# Altium schematic sheet HAL_1.SchDoc
size A
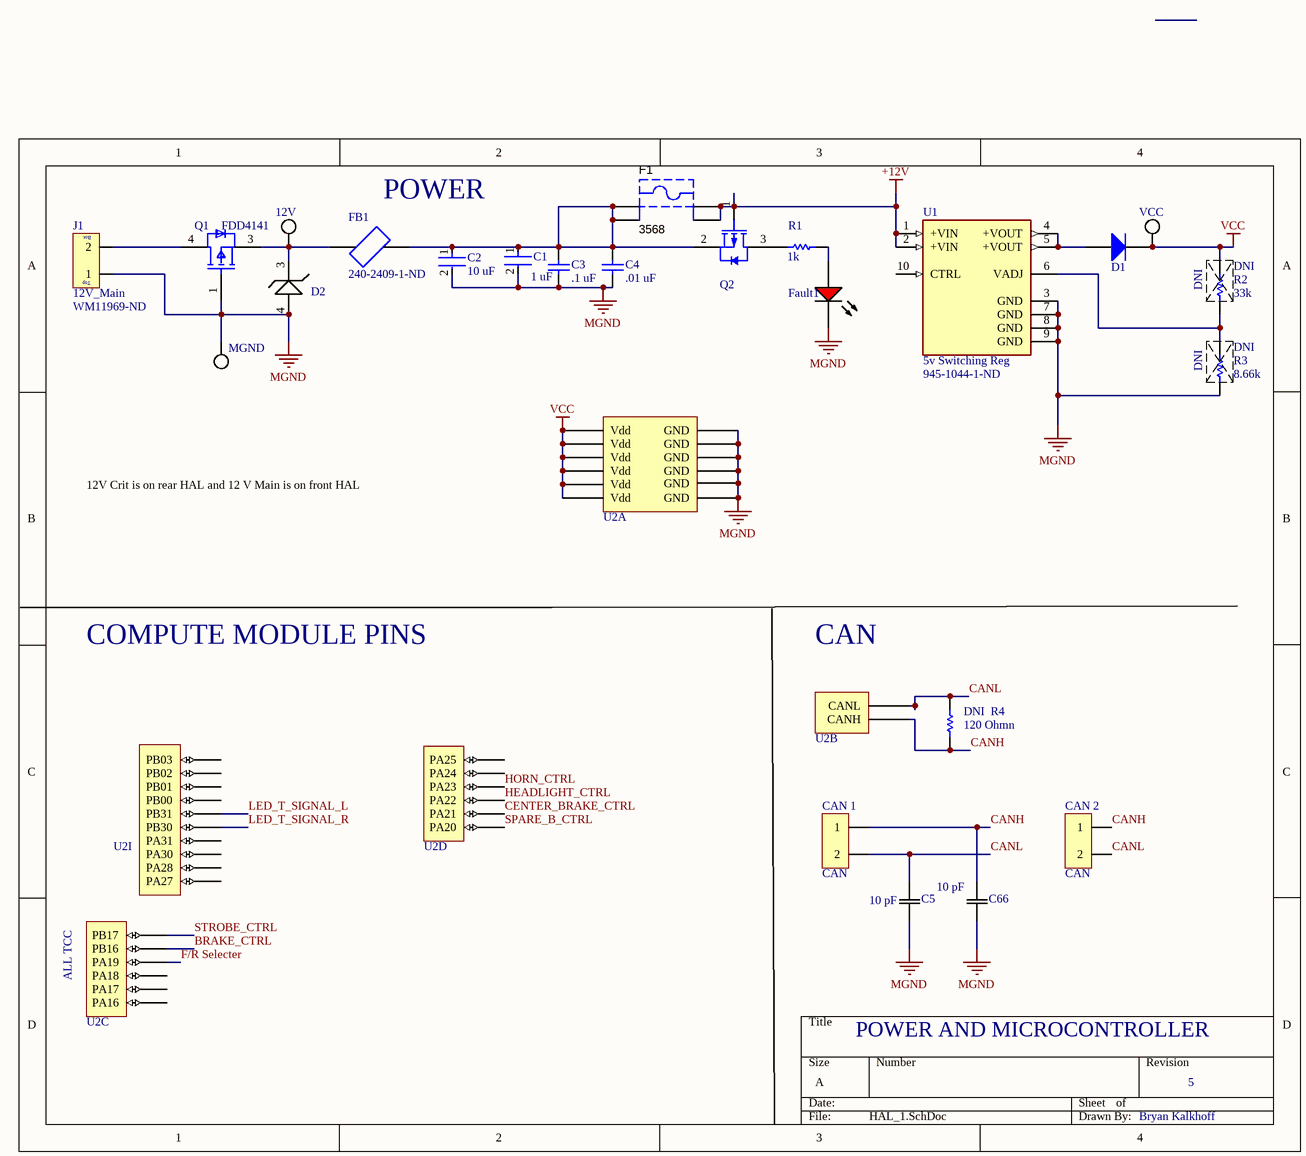
[diagram p0: HAL_1.SchDoc]

## Parts
(Parts that share a designator on the sheet are numbered #1, #2 ... from top to bottom, then left to right.)
12V  12V crit  [EPAD]  (value not drawn)  (no BOM)
C1  1 uF  [FP-CL31-IPC_A]
C2  10 uF  [FP-CL31-IPC_A]
C3  .1 uF  [CAPC2013X140X50LL20T25]
C4  .01 uF  [CAPC1608X90X35LL15T15]
C5  10 pF  [CAP_CL21_SAM-M]
C66  10 pF  [CAP_CL21_SAM-M]
CAN_1  CAN  [Mini-Fit Jr. 2]
CAN_2  CAN  [Mini-Fit Jr. 2]
D1  1N4001-T  [DIOD-DO-41-P-2_V]  (value not drawn)
D2  TVS DIODE 12.4V 20.1V DO219AB  [TVS DIODE 12.4V 20.1V DO219AB]  (value not drawn)
DNI?#1  DO NOT INSTALL  (value not drawn)  (graphical)
DNI?#2  DO NOT INSTALL  (value not drawn)  (graphical)
F1  3568  [KSTN-3568_V]
Fault1  HSMH-C150  [AVAG-HSMX-C150_V]  (value not drawn)
FB1  Supplier Part Number 1: 240-2409-1-ND  [80_FB_1206]  (hidden comment: HI1206N800R-10)
J1  12V_Main  Supplier Part Number 1: WM11969-ND  [MEGA_2P_2x1]
MGND  MGND  [EPAD]  (value not drawn)  (no BOM)
Q1  FDD4141  [FP-369AS-MFG]
Q2  IRLML6402TRPBF  [INTR-SOT-23-3_V]  (value not drawn)
R1  1k  [RESC3216X70X40LL20T20]
R2  33k  [RESC2013X50X30LL20T20]
R3  8.66k  [RESC2013X60X35ML10T20]
R4  120 Ohmn  [RESC2013X50X40LL20T20]
U1  5v Switching Reg  Supplier Part Number 1: 945-1044-1-ND  [10-SMD]
U2  S+  [Compute S+]  (value not drawn)  (parts A,B,C,D,I of 9)
VCC  VCC  [EPAD]  (value not drawn)  (no BOM)

## Nets
+12V: F1.3 F1.4 Q2.1(GATE) U1.1(+VIN) U1.2(+VIN)
MGND: C1.2 C2.2 C3.1 C4.1 C5.1 C66.1 D2.4 Fault1.2(K) J1.1 MGND.1 Q1.1(G) R3.1 U1.3(GND) U1.7(GND) U1.8(GND) U1.9(GND) U2.GND
VCC: D1.2(K) R2.2 U2.Vdd VCC.1
BRAKE_CTRL: U2.PB16
CANH: C66.2 CAN_1.1 CAN_2.1 R4.2 U2.CANH
CANL: C5.2 CAN_1.2 CAN_2.2 R4.1 U2.CANL
CENTER_BRAKE_CTRL: U2.PA21
F/R Selecter: U2.PA19
HEADLIGHT_CTRL: U2.PA22
HORN_CTRL: U2.PA23
LED_T_SIGNAL_L: U2.PB31
LED_T_SIGNAL_R: U2.PB30
SPARE_B_CTRL: U2.PA20
STROBE_CTRL: U2.PB17
Net12V_1: 12V.1 D2.3 FB1.1 Q1.3(S)
NetC1_1: C1.1 C2.1 C3.2 C4.2 F1.1 F1.2 FB1.2 Q2.2(SOURCE)
NetD1_1: D1.1(A) U1.4(+VOUT) U1.5(+VOUT)
NetFault1_1: Fault1.1(A) R1.2
NetJ1_2: J1.2 Q1.4(D)
NetQ2_3: Q2.3(DRAIN) R1.1
NetR2_1: R2.1 R3.2 U1.6(VADJ)

Not connected (* = marked no-connect by the designer): U1 10(CTRL); U2 PA16 PA17 PA18 PA24 PA25 PA27 PA28 PA30 PA31 PB00 PB01 PB02 PB03

## Notes on the sheet
- POWER
- DNI
- 12V Crit is on rear HAL and 12 V Main is on front HAL
- COMPUTE MODULE PINS
- CAN
- (near R4) DNI
- (near U2) ALL TCC
- POWER AND MICROCONTROLLER
- 5
- Bryan Kalkhoff
- (in symbol MEGA_2P_2x1) Bot.; Top

## Library data of the parts
12V MGND VCC = EPAD: Pad for probing signals
C1 C2 = CMP-13271-002819-1: Cap Ceramic 10uF 16V X5R ±10% SMD 1206 +85°C Embossed T/R; Length: 3.2mm; Voltage: 16V; Thickness: 0.071inch; Width: 0.063inch; Radiation Hardening: No; Tolerance: 10%; Min Operating Temperature: -55°C; Mount: Surface Mount; Voltage Rating: 16V; Capacitance: 10uF; Material: Ceramic; Case Code (Metric): 3216; Depth: 1.6mm; Packaging: Tape and Reel; Lead Free: Lead Free; Dielectric: X5R; Contact Plating: Tin; Case Code (Imperial): 1206; Height: 1.6mm; Voltage Rating (DC): 16V; Max Operating Temperature: 85°C; Case/Package: 1206
C3 = CMP-2007-04740-1: Part Number: 08051C104M4Z2A; Manufacturer: AVX Interconnect / Elco
C4 = CMP-2006-04438-1: Part Number: 06035C472K4T4A; Manufacturer: AVX Interconnect / Elco
C5 C66 = CL21C100CBANNNC: No Description Available; Mfr_Name: Samsung; Type: DEV; Copyright: Copyright (C) 2021 Ultra Librarian. All rights reserved.; Manufacturer_Part_Number: CL21C100CBANNNC; Digi-Key_Part_Number_1: 1276-2561-2-ND; Digi-Key_Part_Number_2: 1276-2561-1-ND; Digi-Key_Part_Number_3: 1276-2561-6-ND; RefDes: RefDes
CAN_1 CAN_2 = Mini-Fit Jr. 2-pin: Mini-Fit Jr. 2-pin Right Angle Mini-Fit Jr. 2-pin; Manufacturer: Molex Inc; Manufacturer Part Number: 0039300020; Connector Type: Header, Shrouded; Number of Positions: 2; Number of Positions Loaded: All; Row Spacing: 0.165" (4.20mm); Ordering: http://search.digikey.com/scripts/DkSearch/dksus.dll?Detail&name=WM1351-ND; Datasheet: http://www.molex.com/pdm_docs/sd/039301020_sd.pdf; Supplier 1: Digi-Key; RoHS: RoHS Compliant; Category: Connectors, Interconnects; Stock 1: 371; Pricing 1: 1=0.77, 10=0.674, 50=0.6078, 100=0.5815, 250=0.5286, 500=0.47574, 1000=0.42288, 2500=0.38324, 5000=0.37002 (USD); Contact Type: Male Pin; Pitch: -; Number of Rows: 2; Contact Mating Length: -; Mounting Type: Through Hole, Right Angle; Termination: Solder; Fastening Type: Locking Ramp; Features: Board Lock; Contact Finish: Tin; Contact Finish Thickness: 200µin (5.08µm); Color: Natural; Packaging: Tray; ComponentLink1URL: http://www.molex.com/pdm_docs/sd/039300020_sd.pdf; ComponentLink1Description: http://www.molex.com/pdm_docs/sd/039300020_sd.pdf
D1 = CMP-0639-00006-2: 1.0 A Rectifier, 15 pF, 50 V, -65 to 150 degC, 2-Pin DO-41 Plastic, RoHS, Tape and Reel; Manufacturer: Diodes Inc; VF (V): 1; CT (pF): 15; Max. IR (uA): 5; VRRM (V): 50; Max. IFSM (A): 30; RoHS: TRUE; Mounting Technology: Through Hole; PartNumber: 1N4001-T; ComponentLink2Description: Datasheet; DatasheetVersion: Rev. 8-2; Operating Temperature Range (degC): -65 to 150; Packing: Tape and Reel; PackageReference: DO-41-P-2; ComponentLink1URL: http://diodes.com/; PackageDescription: 2-Pin Axial Lead, Body 4.635 x 2.36 mm, Lead Spread 25.4 mm; ComponentLink2URL: http://diodes.com/datasheets/ds28002.pdf; Max. Average Rectified Current IO (A): 1; ComponentLink1Description: Manufacturer URL
DNI?#1 DNI?#2 = DNI
F1 = CMP-2000-05464-1: Fuse Holder, 20 A, 500 V, -50 to 145 degC, 4-Pin THD, RoHS; Manufacturer: Keystone; Package Reference: 3568; Datasheet Version: 04/2013; Datasheet URL: https://datasheet.ciiva.com/16294/m60-2p40-16294706.pdf; Manufacturer URL: http://www.keyelco.com/; Mounting Technology: ThroughHole; Package Description: 4-Pin Through Hole Device, Body 16 x 6.73 mm, Pitch 9.9 mm
Fault1 = CMP-2000-06426-1: LED Uni-Color Red, 65 mW, 25 mA, -40 to 85 degC, 2-Pin SMD, RoHS, Tape and Reel; Manufacturer: Avago; Product Height (mm): 1.1mm; Power Dissipation: 78W; Product Length (mm): 3.2mm; Forward Voltage: 2.6V; Luminous Intensity: 17mcd; DELETED: Compliant; Shape Type: Rectangular; Peak Wavelength: 660nm; Main Category: ChipLED; Dominant Wave Length: 639nm; Rad Hardened: No; Lens Type: ColorlessDiffused; Product Depth (mm): 1.6mm; Reverse Voltage: 5V; Forward Current: 25mA; Chip Material: GaAlAs; Test Current (It): 20mA; Viewing Angle: 170deg; Number of  Elements: 1; Type: Uni-Color; Package Reference: HSMX-C150; Package Description: 2-Pin Surface Mount Device, Body 3.2 x 1.6 mm; Operating Temp Range: -40Cto85C; Mounting: SurfaceMount; Emitting Color: Red; Pin Count: 2; Operating Temperature Classification: Industrial; Datasheet URL: http://media.digikey.com/pdf/Data%20Sheets/Avago%20PDFs/HSMz-Czzz.pdf; Package Type: ChipLed; Mounting Technology: SurfaceMount; High Brightness: No; Lens Dimensions: 2x1.6x0.6mm; Manufacturer URL: http://www.avagotech.com/; Lum Intensity: 17mcd; Datasheet Version: 03/2012; Packaging: TapeandReel
FB1 = 80_FB_1206: Ferrite Chip, 1 Function(s), 3A, 2 Pin(s); Manufacturer: Laird Steward; Manufacturer Series: HI; MF: Laird-Signal Integrity; Value: 80R; DC Resistance-Max: 35mR; Number of Functions: 1; Max Frequency: 100MHz; SnapEDA_Link: https://www.snapeda.com/parts/HI1206N800R-10/Laird-Signal%20Integrity%20Products/view-part/296889/?ref=snap; Purchase-URL: https://pricing.snapeda.com/search/part/HI1206N800R-10/?ref=eda; Check_prices: https://www.snapeda.com/parts/HI1206N800R-10/Laird-Signal%20Integrity%20Products/view-part/296889/?ref=eda; Digi-Key_Part_Number: 240-2409-1-ND; Package: 1206 Laird-Signal Integrity; MP: HI1206N800R-10; Supplier 1: Digi-Key; Manufacturer Part Number: HI1206N800R-10; RoHS: Yes; Category: Fixed Inductors; Stock 1: 9365; Pricing 1: 1=0.23000, 10=0.18500, 25=0.14400, 50=0.11920, 100=0.10280, 250=0.08220, 500=0.07400, 1000=0.06166 (USD); Mount: Surface Mount; Terminal Finish: Nickel; Material: Ferrite; Case Code: 1206; Min Operating Temperature: -55°C; Max Operating Temperature: 125°C; JESD-609 Code: e3; Filter Type: FERRITE CHIP; Output Impedance: 80R; Packaging: Tape and Reel; Construction: Chip Bead; Min Frequency: 100MHz; Current Rating: 3A; Series: HI1206N800R; Length: 3.2mm; Width: 1.6mm; Height: 1.1mm; REACH SVHC: No SVHC; RoHS Compliant: Yes; ComponentLink1URL: https://datasheet.ciiva.com:443/pdfs/VipMasterIC/IC/STWD/STWDS00332/STWDS00332-1.pdf?src-supplier=IHS+Markit; ComponentLink1Description: https://datasheet.ciiva.com:443/pdfs/VipMasterIC/IC/STWD/STWDS00332/STWDS00332-1.pdf?src-supplier=IHS+Markit; ComponentLink2URL: https://datasheet.ciiva.com/3081/hi1206n800r-10-a-vp-3081809.pdf?src-supplier=Avnet; ComponentLink2Description: https://datasheet.ciiva.com/3081/hi1206n800r-10-a-vp-3081809.pdf?src-supplier=Avnet; ComponentLink3URL: https://datasheet.ciiva.com/22622/1685745-22622768.pdf?src-supplier=Element14; ComponentLink3Description: https://datasheet.ciiva.com/22622/1685745-22622768.pdf?src-supplier=Element14; ComponentLink4URL: https://datasheet.ciiva.com/16714/70065439-16714107.pdf?src-supplier=Allied+Electronics; ComponentLink4Description: https://datasheet.ciiva.com/16714/70065439-16714107.pdf?src-supplier=Allied+Electronics
J1 = MEGA_2P_2x1: MOLEX - 76825-0002 - Wire-To-Board Connector, 2 Contacts, Header, Mega-Fit 76825 Series, Through Hole, 2 Rows; Manufacturer Part Number: 0768250002; SchematicInformation: MegaFit_2P; Manufacturer: Molex; DigiKey Part Number: WM11969-ND; Supplier 1: Digi-Key; RoHS: Yes; Category: Headers and Wire Housings; Stock 1: 16040; Pricing 1: 1=1.31000, 10=1.08200, 80=0.90150, 1850=0.67615, 3700=0.65361 (USD); ComponentLink1URL: http://www.farnell.com/datasheets/2216551.pdf?src-supplier=Farnell; ComponentLink1Description: http://www.farnell.com/datasheets/2216551.pdf?src-supplier=Farnell; ComponentLink2URL: https://www.molex.com/pdm_docs/sd/768250002_sd.pdf?src-supplier=Digi-Key; ComponentLink2Description: https://www.molex.com/pdm_docs/sd/768250002_sd.pdf?src-supplier=Digi-Key; ComponentLink3URL: http://www.farnell.com/datasheets/2216551.pdf?src-supplier=Newark; ComponentLink3Description: http://www.farnell.com/datasheets/2216551.pdf?src-supplier=Newark
Q1 = CMP-07173-000088-1: MOSFET P-CH 40V 10.8A DPAK; Manufacturer: ON Semiconductor; Gate Charge At Vgs: 36nC @ -10V; Transconductance: 38S; Drain To Source Breakdown Voltage: -40V; Reverse Recovery Time: 29ns; Pulse Drain Current: -100A; Reverse Recovery Charge: 26nC; Drain To Source Resistance: 10.1mΩ; Power Dissipation: 2.4W; Max Forward Diode Voltage: -1.2V; Turn Off Delay Time: 38ns; Number Of P Channels: 1; Gate To Source Voltage: 20V; Rthja Max: 52°C/W; Depletion Mode: False; Threshold Vgs Max: -3V; Threshold Vgs Min: -1V; Turn On Delay Time: 10ns; Max Junction Temp: +150°C; Input Capacitace At Vds: 2085pF @ -20V; Continuous Drain Current: -10.8A; Typ Forward Diode Voltage: -0.8V; Package: 369AS; Category: Diode; RoHS: TRUE; Device Class L2: Transistors; Octopart: https://octopart.com/fdd4141-on+semiconductor-84325802; Temperature: -55°C to +150°C; Drain To Source Voltage: -40V; Device Class L1: Discrete Semiconductors; Temperature Range Low: -55°C; Height: 2.517mm; ComponentLink2Description: Datasheet; Automotive: No; Number Of Channels: 1; Digikey Description: MOSFET P-CH 40V 10.8A DPAK; Lead Free: Yes; Manufacturer Part Number: FDD4141; Temperature Range High: +150°C; Footprint Url: https://www.onsemi.com/pub/Collateral/369AS.PDF; Device Class L3: MOSFETs; Mouser Description: MOSFET -40V P-Channel PowerTrench; ComponentLink2URL: https://www.onsemi.com/pub/Collateral/FDD4141-D.pdf
Q2 = CMP-2000-04987-1: HEXFET(R) Power P-Channel MOSFET, -20 V, -3.7 A, -55 to 150 degC, 3-Pin SOT-23, RoHS, Tape and Reel; Manufacturer: International Rectifier; Drain-to-Source Voltage [Vdss]: 20V; Rated Power Dissipation: 1.3W; Qg Gate Charge: 8nC; Drain-Source On Resistance-Max: 0.065O; Channel Type: P-Channel; Package Reference: SOT-23-3; Manufacturer URL: http://internationalrectifier.com/; Datasheet URL: http://datasheet.octopart.com/IRLML6402TRPBF-International-Rectifier-datasheet-93882.pdf; Datasheet Version: Feb-05; Package Description: 3-Pin Small Outline Transistor, Body 2.92 x 1.3 mm, Pitch 0.95 mm
R1 = CMP-2003-04517-1: RK73B2BTTD102J; Manufacturer: KOA Speer; Part Number: RK73B2BTTD102J
R2 = CMP-2001-03828-1: CRCW080533K0JNEA; Manufacturer: Vishay Dale; Part Number: CRCW080533K0JNEA
R3 = CMP-2001-01296-1: RC0805FR-078K66L; Manufacturer: Yageo; Part Number: RC0805FR-078K66L
R4 = CMP-2001-03236-1: RR1220P-121-D; Manufacturer: Susumu; Part Number: RR1220P-121-D
U1 = 18/6.5V_5V_1A_SWITCH_10-SMD: DC-DC Regulated Power Supply Module, 1 Output, 5W, Hybrid; Manufacturer: Recom; MF: Recom Power; MP: R-78AA5.0-1.0SMD-R; Package Body Material: Plastic; Max Input Voltage: 18V; Min Input Voltage: 6.5V; Max Output Current: 1A; Qualification Status: Not Qualified; Value: *; Package: SMD-10 Recom Power; DigiKey-Purchase-URL: https://snapeda.com/shop?store=DigiKey&id=480105; SnapEDA_Link: https://www.snapeda.com/parts/R-78AA5.0-1.0SMD-R/Recom%20Power/view-part/480105/?ref=snap; Mouser-Purchase-URL: https://snapeda.com/shop?store=Mouser&id=480105; Digi-Key_Part_Number: 945-1044-1-ND; BuyPart: https://www.snapeda.com/parts/R-78AA5.0-1.0SMD-R/Recom%20Power/view-part/480105/?ref=eda; DigiKey: 945-1044-2-ND; Supplier 1: Digi-Key; Manufacturer Part Number: R-78AA5.0-1.0SMD-R; RoHS: Yes; Category: Voltage Regulators - Switching; Stock 1: 5089; Pricing 1: 1=9.84000, 5=9.75800, 10=9.68300, 25=9.53440, 50=9.23640, 100=8.43000 (USD); Package Code: SOP; Number of Pins: 10; Package Shape: Rectangular; Min Operating Temperature: -40°C; Max Operating Temperature: 85°C; Analog IC - Other Type: DC-DC REGULATED POWER SUPPLY MODULE; Nominal Output Voltage: 5V; Package Style: SMALL OUTLINEMeter; Surface Mount: Yes; Terminal Form: Gull Wing; Terminal Position: DUAL; Terminal Pitch: 2.54mm; Temperature Grade: INDUSTRIAL; REACH SVHC: Yes; RoHS Compliant: Yes; ComponentLink1URL: https://datasheet.ciiva.com:443/pdfs/VipMasterIC/IC/RECG/RECG-S-A0007788603/RECG-S-A0007788603-1.pdf?src-supplier=IHS+Markit; ComponentLink1Description: https://datasheet.ciiva.com:443/pdfs/VipMasterIC/IC/RECG/RECG-S-A0007788603/RECG-S-A0007788603-1.pdf?src-supplier=IHS+Markit; ComponentLink2URL: https://datasheet.ciiva.com/2374/r-78aaxx-1-0smd-2374214.pdf?src-supplier=Digi-Key; ComponentLink2Description: https://datasheet.ciiva.com/2374/r-78aaxx-1-0smd-2374214.pdf?src-supplier=Digi-Key; ComponentLink3URL: https://datasheet.ciiva.com/2374/r-78aaxx-1-0smd-2374215.pdf?src-supplier=Digi-Key; ComponentLink3Description: https://datasheet.ciiva.com/2374/r-78aaxx-1-0smd-2374215.pdf?src-supplier=Digi-Key; ComponentLink4URL: https://datasheet.ciiva.com/2374/r-78aaxx-1-0smd-2374216.pdf?src-supplier=Digi-Key; ComponentLink4Description: https://datasheet.ciiva.com/2374/r-78aaxx-1-0smd-2374216.pdf?src-supplier=Digi-Key
U2 = S+: Need to get 4 of PPPC161LFBN-RC; Digi-key: https://www.digikey.com/product-detail/en/sullins-connector-solutions/PPPC161LFBN-RC/S7049-ND/810188; datasheet: https://media.digikey.com/pdf/Data%20Sheets/Sullins%20PDFs/Female_Headers.100_DS.pdf
D2 = TVS DIODE 12.4V 20.1V DO219AB: ComponentLink1Description: Digikey; ComponentLink1URL: https://www.digikey.com/product-detail/en/vishay-semiconductor-diodes-division/VTVS12ASMF-M3-08/112-VTVS12ASMF-M3-08CT-ND/7055981; ComponentLink2Description: Datasheet; ComponentLink2URL: http://www.vishay.com/docs/85891/vtvs3v3asmf.pdf